# Altium schematic sheet LCD.SchDoc
size A4; SheetNumber: 8; SheetTotal: 9
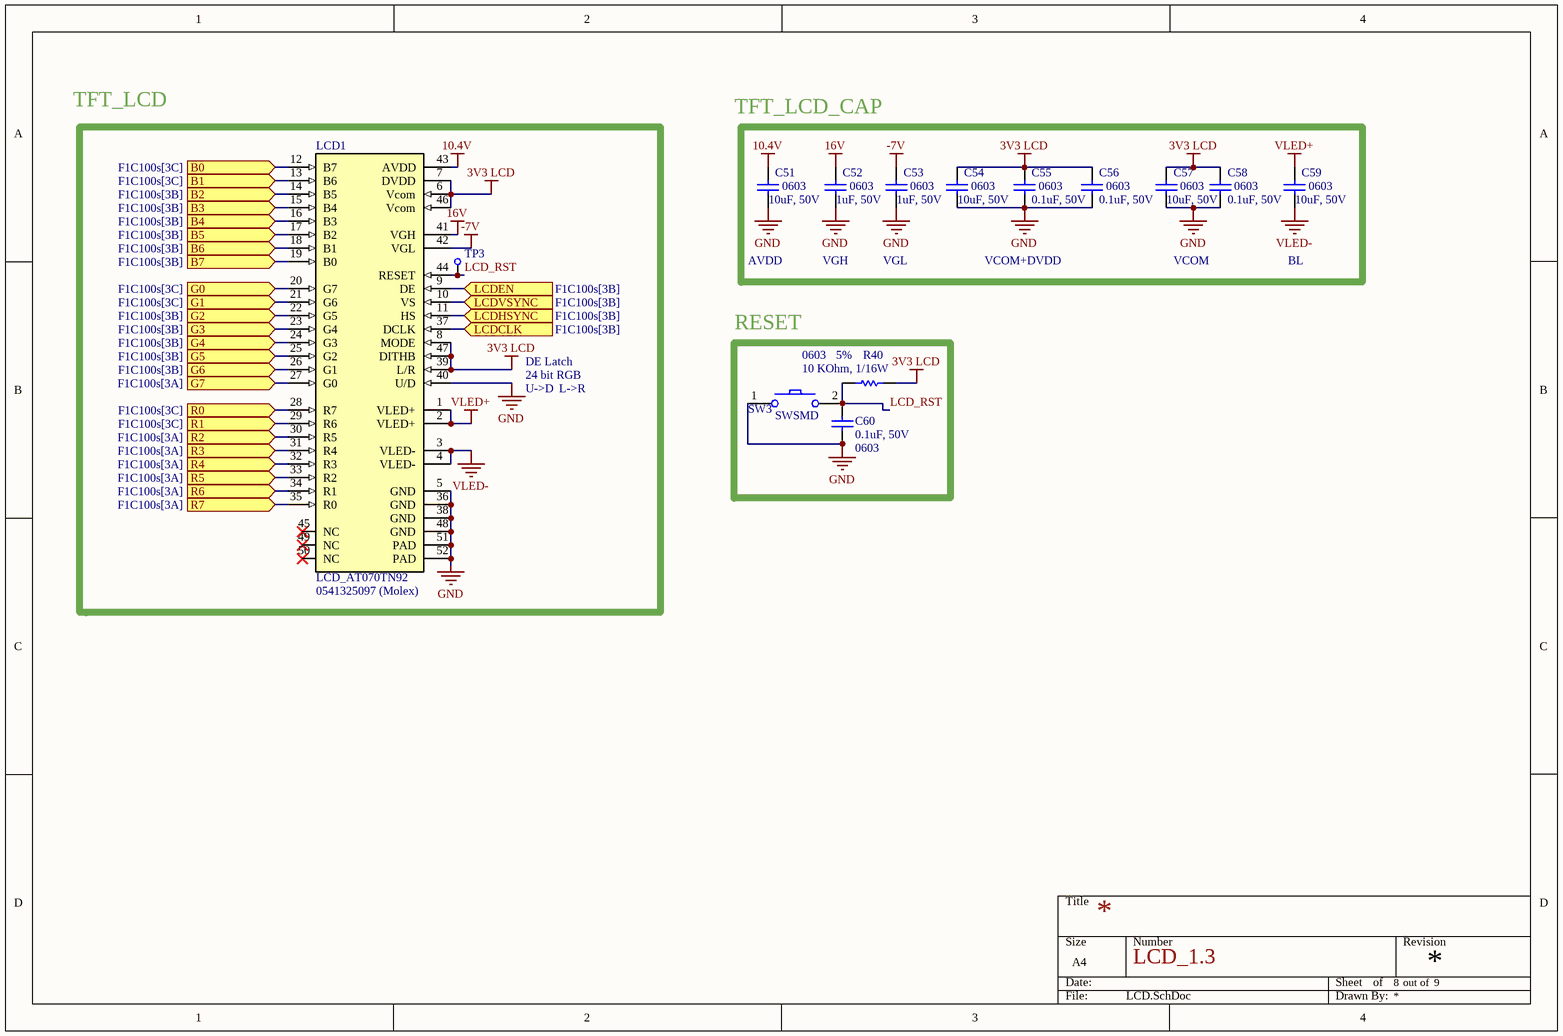
[diagram p0: LCD.SchDoc]

## Parts
C51  Package: 0603  [C_0603]  (hidden comment: 10uF, 50V)
C52  Package: 0603  [C_0603]  (hidden comment: 1uF, 50V)
C53  Package: 0603  [C_0603]  (hidden comment: 1uF, 50V)
C54  Package: 0603  [C_0603]  (hidden comment: 10uF, 50V)
C55  Package: 0603  [C_0603]  (hidden comment: 0.1uF, 50V)
C56  Package: 0603  [C_0603]  (hidden comment: 0.1uF, 50V)
C57  Package: 0603  [C_0603]  (hidden comment: 10uF, 50V)
C58  Package: 0603  [C_0603]  (hidden comment: 0.1uF, 50V)
C59  Package: 0603  [C_0603]  (hidden comment: 10uF, 50V)
C60  Package: 0603  [C_0603]  (hidden comment: 0.1uF, 50V)
LCD1  LCD_AT070TN92  Connector Part Number: 0541325097 (Molex)  [CONN_LCD_AT070TN90]
R40  Package: 0603  Acc: 5%  [R_0603]  (hidden comment: 10 KOhm, 1/16W)
SW3  SWSMD  [SW_SMD_NOGND]
TP3  TESTPT  [TESTPT]  (value not drawn)  (no BOM)

## Blocks framed on the sheet
RESET: C60 R40 SW3

## Ports
B0 (in, see F1C100s[3C]), B1 (in, see F1C100s[3C]), B2 (in, see F1C100s[3B]), B3 (in, see F1C100s[3B]), B4 (in, see F1C100s[3B]), B5 (in, see F1C100s[3B]), B6 (in, see F1C100s[3B]), B7 (in, see F1C100s[3B]), G0 (in, see F1C100s[3C]), G1 (in, see F1C100s[3C]), G2 (in, see F1C100s[3B]), G3 (in, see F1C100s[3B]), G4 (in, see F1C100s[3B]), G5 (in, see F1C100s[3B]), G6 (in, see F1C100s[3B]), G7 (in, see F1C100s[3A]), LCDCLK (in, see F1C100s[3B]), LCDEN (in, see F1C100s[3B]), LCDHSYNC (in, see F1C100s[3B]), LCDVSYNC (in, see F1C100s[3B]), R0 (in, see F1C100s[3C]), R1 (in, see F1C100s[3C]), R2 (in, see F1C100s[3A]), R3 (in, see F1C100s[3A]), R4 (in, see F1C100s[3A]), R5 (in, see F1C100s[3A]), R6 (in, see F1C100s[3A]), R7 (in, see F1C100s[3A])

## Nets
3V3 LCD: C54.2 C55.2 C56.2 C57.2 C58.2 LCD1.6(Vcom) LCD1.7(DVDD) LCD1.8(MODE) LCD1.39(L/R) LCD1.46(Vcom) LCD1.47(DITHB) R40.2
10.4V: C51.2 LCD1.43(AVDD)
16V: C52.2 LCD1.41(VGH)
-7V: C53.2 LCD1.42(VGL)
GND: C51.1 C52.1 C53.1 C54.1 C55.1 C56.1 C57.1 C58.1 C60.1 LCD1.5(GND) LCD1.36(GND) LCD1.38(GND) LCD1.40(U/D) LCD1.48(GND) LCD1.51(PAD) LCD1.52(PAD) SW3.1
VLED+: C59.2 LCD1.1(VLED+) LCD1.2(VLED+)
VLED-: C59.1 LCD1.3(VLED-) LCD1.4(VLED-)
B0: LCD1.12(B7) ; port B0
B1: LCD1.13(B6) ; port B1
B2: LCD1.14(B5) ; port B2
B3: LCD1.15(B4) ; port B3
B4: LCD1.16(B3) ; port B4
B5: LCD1.17(B2) ; port B5
B6: LCD1.18(B1) ; port B6
B7: LCD1.19(B0) ; port B7
G0: LCD1.20(G7) ; port G0
G1: LCD1.21(G6) ; port G1
G2: LCD1.22(G5) ; port G2
G3: LCD1.23(G4) ; port G3
G4: LCD1.24(G3) ; port G4
G5: LCD1.25(G2) ; port G5
G6: LCD1.26(G1) ; port G6
G7: LCD1.27(G0) ; port G7
LCD_RST: C60.2 LCD1.44(RESET) R40.1 SW3.2 TP3.1
LCDCLK: LCD1.37(DCLK) ; port LCDCLK
LCDEN: LCD1.9(DE) ; port LCDEN
LCDHSYNC: LCD1.11(HS) ; port LCDHSYNC
LCDVSYNC: LCD1.10(VS) ; port LCDVSYNC
R0: LCD1.28(R7) ; port R0
R1: LCD1.29(R6) ; port R1
R2: LCD1.30(R5) ; port R2
R3: LCD1.31(R4) ; port R3
R4: LCD1.32(R3) ; port R4
R5: LCD1.33(R2) ; port R5
R6: LCD1.34(R1) ; port R6
R7: LCD1.35(R0) ; port R7

Not connected (* = marked no-connect by the designer): LCD1 45(NC)* 49(NC)* 50(NC)*

## Notes on the sheet
- TFT_LCD
- TFT_LCD_CAP
- AVDD
- VGH
- VGL
- VCOM+DVDD
- VCOM
- BL
- DE Latch
- 24 bit RGB
- U->D
- L->R
- LCD_1.3
- out of

## Library data of the parts
C51-C60 = CAP_0603: Manufacturer 1: Vishay; Manufacturer Part Number 1: CAP0603; Supplier 1: Thegioiic; Datasheet: https://www.mouser.de/datasheet/2/447/PYu_RC_Group_51_RoHS_L_11-1984063.pdf; Supplier Link: N/a
  C51 C54 C57 C59: Value: 10uF, 50V
  C52 C53: Value: 1uF, 50V
  C55 C56 C58 C60: Value: 0.1uF, 50V
LCD1 = LCD_AT070TN92: LCD 7 inch (800 x 3(RGB) x 480) RES / __NOTE THAT THIS IS FFC 50PINS CONN w/ THE LCD FOOTPRINT!__; Manufacturer 1: INNOLUXDISPLAY Corp.; Manufacturer Part Number 1: AT070TN92; Supplier 1: Thegioiic (Out of stock); Datasheet: https://mm.digikey.com/Volume0/opasdata/d220001/medias/docus/530/AT070TN92_Jan12_2009_spec.pdf; Supplier Link: https://www.thegioiic.com/lcd-7inch-rbg-800x480-at070tn92-tft-rgb-innolux
R40 = RES_0603: Manufacturer 1: Vishay; Manufacturer Part Number 1: RES0603; Supplier 1: Thegioiic; Datasheet: https://www.mouser.de/datasheet/2/447/PYu_RC_Group_51_RoHS_L_11-1984063.pdf; Supplier Link: N/a; Value: 10 KOhm, 1/16W
SW3 = SWSMD_NOGND: SW_SMD; Manufacturer 1: OEM; Manufacturer Part Number 1: N/a; Supplier 1: Thegioiic; Datasheet: N/a; Supplier Link: https://www.thegioiic.com/nut-nhan-3x6mm-cao-3-5mm-4-chan-smd-chinh-ngang
TP3 = TESTPT: Test point